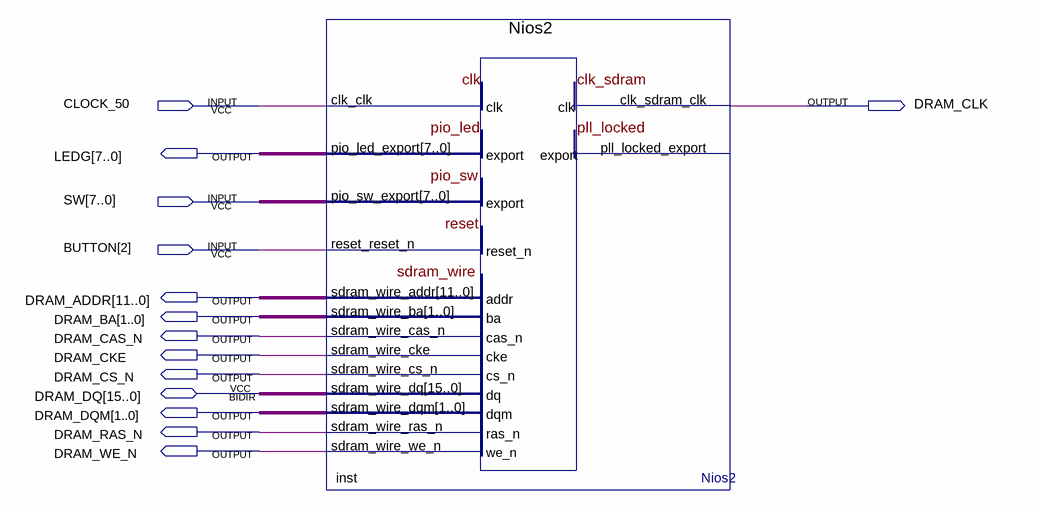
[diagram p0: schematic sheet]
// Quartus schematic Nios2_top.bdf as structural Verilog: 1 symbols, 14 pins
module Nios2_top (
  input  CLOCK_50,
  input  [7:0] SW,
  input  [2:2] BUTTON,
  inout  [15:0] DRAM_DQ,
  output DRAM_CLK,
  output [7:0] LEDG,
  output [11:0] DRAM_ADDR,
  output [1:0] DRAM_BA,
  output DRAM_CAS_N,
  output DRAM_CKE,
  output DRAM_CS_N,
  output [1:0] DRAM_DQM,
  output DRAM_RAS_N,
  output DRAM_WE_N
);

  Nios2 inst (
    .clk_clk(CLOCK_50), .pio_sw_export(SW), .reset_reset_n(BUTTON[2]), .clk_sdram_clk(DRAM_CLK),
    .pio_led_export(LEDG), .sdram_wire_addr(DRAM_ADDR), .sdram_wire_ba(DRAM_BA),
    .sdram_wire_cas_n(DRAM_CAS_N), .sdram_wire_cke(DRAM_CKE), .sdram_wire_cs_n(DRAM_CS_N),
    .sdram_wire_dqm(DRAM_DQM), .sdram_wire_ras_n(DRAM_RAS_N), .sdram_wire_we_n(DRAM_WE_N),
    .sdram_wire_dq(DRAM_DQ));  // open: pll_locked_export
endmodule
